# EAGLE design ISPAdapter (EAGLE 7.6.0)
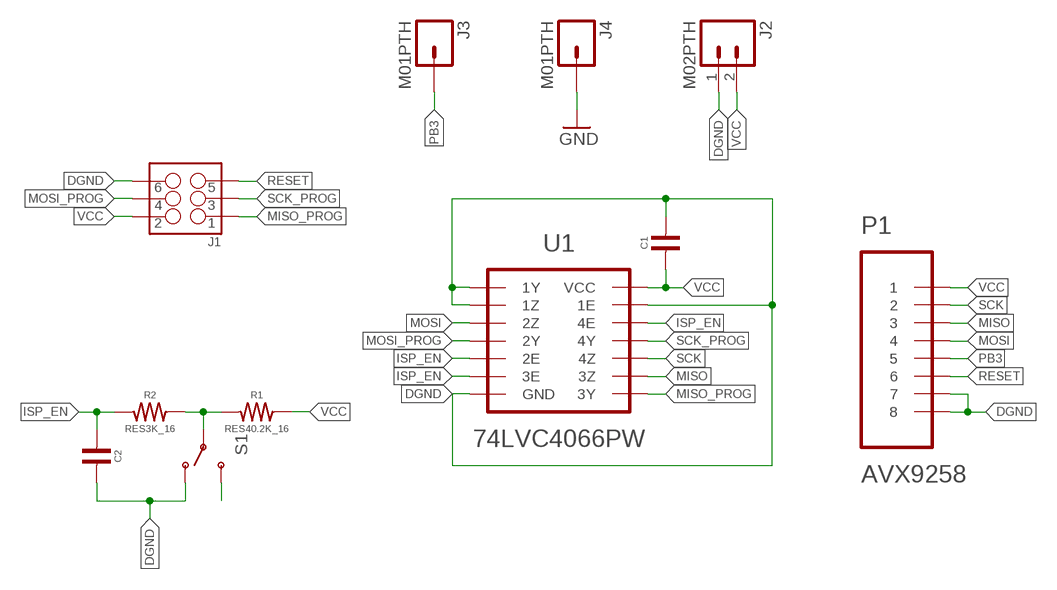
[diagram p0: schematic, sheet 1]

## Parts
C1  CAP4.7UF_10V  [0402]
C2  CAP0.1UF_100V  [0402]
J1  M03X2WR  [WR-BHD-3X2]
J2  M02PTH  [1X02]
J3  M01PTH  [1X01]
J4  M01PTH  [1X01]
P1  AVX9258  [AVX9258-8C]
R1  RES40.2K_16  [0402]
R2  RES3K_16  [0402]
S1  SWITCH-SPDTESWITCH  [EG1271A]
U1  74LVC4066PW  [14-TSSOP]

## Nets
DGND: C1.2 C2.2 J1.6 J2.1 P1.7 P1.8 S1.1(O) S1.4(O) U1.1(1Y) U1.2(1Z) U1.7(GND) U1.13(1E)
GND: J4.1
ISP_EN: C2.1 R2.1 U1.5(2E) U1.6(3E) U1.12(4E)
MISO: P1.3 U1.9(3Z)
MISO_PROG: J1.1 U1.8(3Y)
MOSI: P1.4 U1.3(2Z)
MOSI_PROG: J1.4 U1.4(2Y)
N$1: S1.3(S) S1.6(S)
PB3: J3.1 P1.5
RESET: J1.5 P1.6
SCK: P1.2 U1.10(4Z)
SCK_PROG: J1.3 U1.11(4Y)
SWGND: R1.1 R2.2 S1.2(P) S1.5(P)
VCC: C1.1 J1.2 J2.2 P1.1 R1.2 U1.14(VCC)

## Library data of the parts
C1 = dubec:CAP: Ceramic capacitor; DIGIKEY_PART_#: 445-13820-1-ND; MANUFACTURER: TDK Corporation; MFG_PART_#: C1005X5R1A475K050BC; TEMP: X5R; TOLERANCE: ±10%; USD: 0.43
C2 = dubec:CAP: Ceramic capacitor; DIGIKEY_PART_#: 490-10458-1-ND; MANUFACTURER: Murata Electronics North America; MFG_PART_#: GRM155R62A104KE14D; TEMP: X5R; TOLERANCE: ±10%; USD: 0.65/10
J1 = SparkFun-Connectors:M03X2: 2x3 .1" header. Shrouded, with keying- CONN-10681 SMT- CONN-11415 Pogo pins- HW-11044; DIGIKEY_PART_#: 732-5394-ND; EURO: 0.85; MANUFACTURER: Wurth Electronics Inc; MFG_PART_#: 61200621621
J2 = SparkFun-Connectors:M02: Standard 2-pin 0.1" header. Use with - straight break away headers ( PRT-00116) - right angle break away headers (PRT-00553) - swiss pins (PRT-00743) - machine pins (PRT-00117) - female headers (PRT-00115) Molex polarized connector foot print use with: PRT-08233 with associated crimp pins and housings. 2.54_SCREWTERM for use with PRT-10571. 3.5mm Screw Terminal footprints for PRT-08084 5mm Screw Terminal footprints for use with PRT-08432
J3 J4 = SparkFun-Connectors:M01: Header 1 Standard 1-pin 0.1" header. Use with straight break away headers (SKU : PRT-00116), right angle break away headers (PRT-00553), swiss pins (PRT-00743), machine pins (PRT-00117), and female headers (PRT-00115).
P1 = dubec:AVX9258; DIGIKEY_PART_#: 478-5495-1-ND; EURO: 1.30; MANUFACTURER: AVX Corporation; MFG_PART_#: 009258008004063
R1 = dubec:RES: Resistor; DIGIKEY_PART_#: 541-40.2KLCT-ND; MANUFACTURER: Vishay Dale; MFG_PART_#: CRCW040240K2FKED; TEMP: ±100ppm/°C; TOLERANCE: ±1%; USD: 2.11/50
R2 = dubec:RES: Resistor; DIGIKEY_PART_#: 541-3.00KLCT-ND; EURO: 2.10/50; MANUFACTURER: Vishay Dale; MFG_PART_#: CRCW04023K00FKED; TEMP: ±100ppm/°C; TOLERANCE: ±1%
S1 = SparkFun-Electromechanical:SWITCH-SPDT: SPDT Switch Simple slide switch, Spark Fun Electronics SKU : COM-00102 DPDT SMT slide switch, AYZ0202, SWCH-08179; DIGIKEY_PART_#: EG1919-ND; EURO: 5.93/10; MANUFACTURER: E-Switch; MFG_PART_#: EG1271A
U1 = dubec:74LVC4066; DIGIKEY_PART_#: 568-3021-5-ND; EURO: 6.29/10; MANUFACTURER: NXP Semiconductors; MFG_PART_#: 74LVC4066PW,112; TEMP: -40°C ~ 125°C

## Board
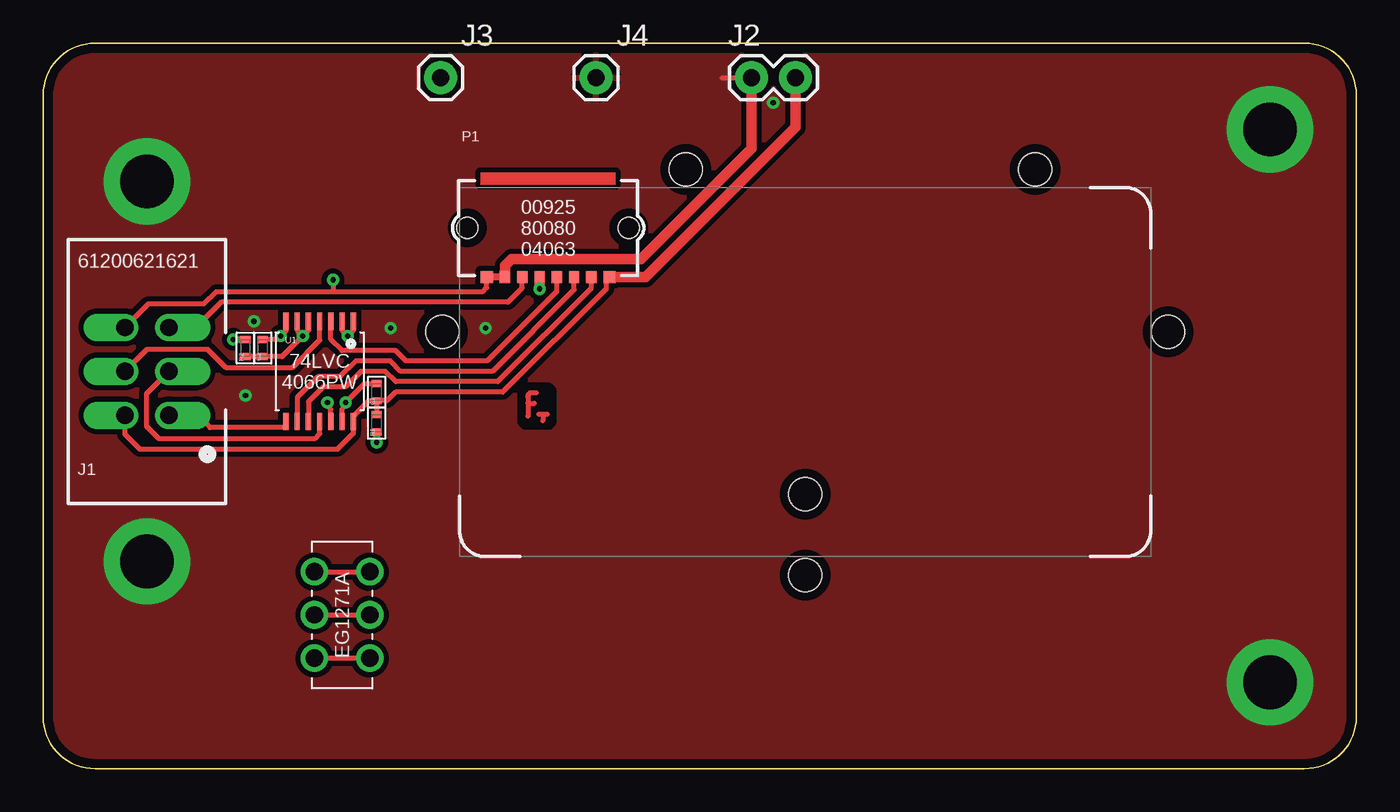
[diagram p1: board, top side]
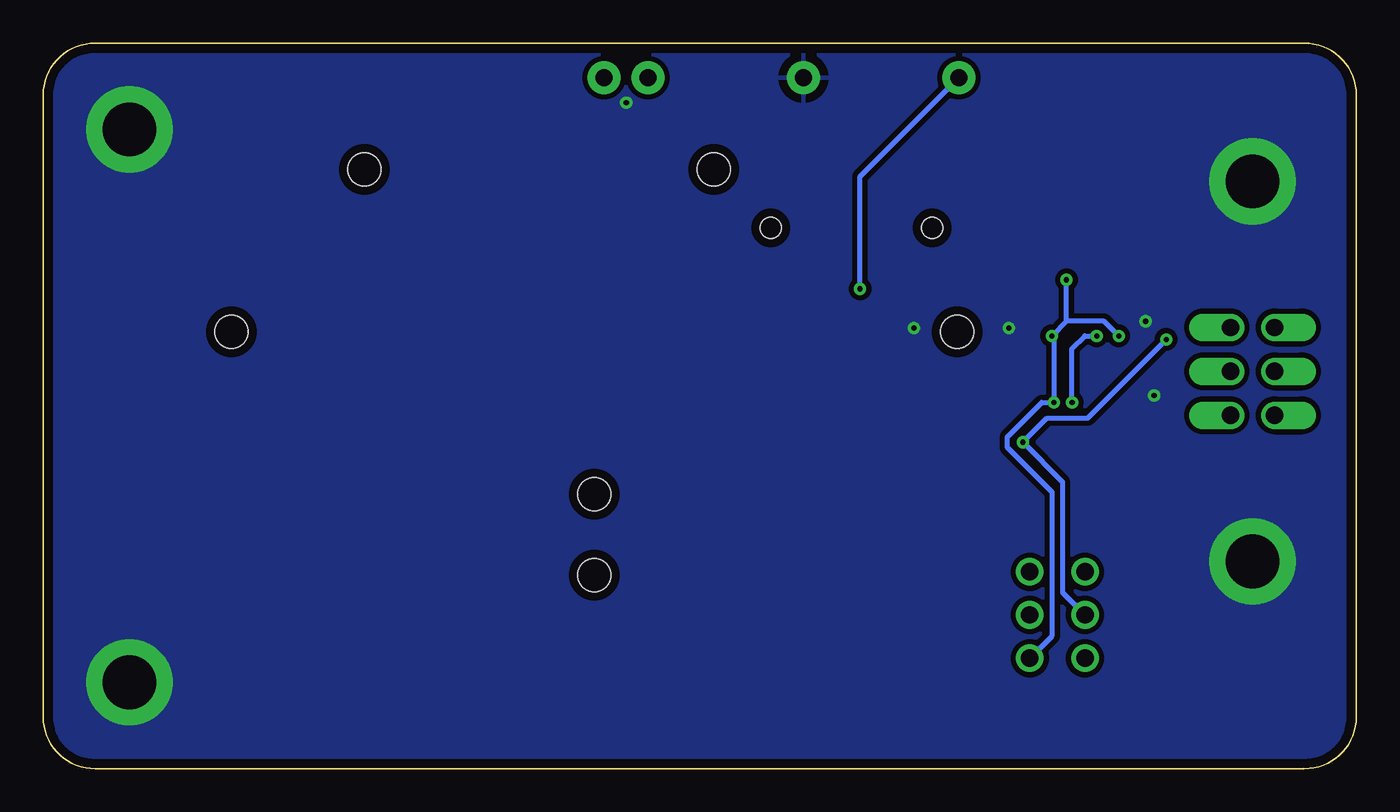
[diagram p2: board, bottom side, seen from below]

Size 76 x 42 mm. Coordinates in mm from the lower left corner, seen from the top.
Outline: 0,3 0,39 arc-90 3,42 73,42 arc-90 76,39 76,3 arc-90 73,0 3,0 arc-90 0,3
Copper layers (1*16): Top 0.035mm / dielectric 1.5mm / Bottom 0.035mm
Design rules "default *": minimum track width 0.25mm, minimum drill 0.3mm, track to track 0.3mm, track to pad 0.3mm, pad to pad 0.3mm, via to via 0.3mm, smd to smd 0mil, copper to edge 20mil, drill to drill 12mil, minimum pad ring 10mil, minimum via ring 8mil, stop-mask expansion 0mil, vias tented up to drill 1mm, thermal gap 0.5mm
Holes 1.9 mm at 37.2,34.7 57.4,34.7 65.1,25.3 23.1,25.3 44.1,15.9 44.1,11.2

### Footprints (pad centres in the part's own frame; a part is rotated, then mirrored left to right if it is on the bottom)
0402 = smd 0.4 x 0.6: 1 -0.5,0; 2 0.5,0
WR-BHD-3X2 = drill 1 pad 1.6 offset: 1 1.27,-2.54; 2 -1.27,-2.54; 3 1.27,0; 4 -1.27,0; 5 1.27,2.54; 6 -1.27,2.54
1X02 = drill 1 pad 1.9: 1 0,0; 2 2.54,0
1X01 = drill 1 pad 1.9: 1 0,0
AVX9258-8C = smd 0.7 x 0.7: 1 3.55,-2.85; 8 -3.55,-2.85 | smd 0.6 x 0.7: 2 2.5,-2.85; 3 1.5,-2.85; 4 0.5,-2.85; 5 -0.5,-2.85; 6 -1.5,-2.85; 7 -2.5,-2.85 | hole 1.2: -4.675,0; 4.675,0
EG1271A = drill 1 pad 1.6: 1 -2.5,1.6; 2 0,1.6; 3 2.5,1.6; 4 -2.5,-1.6; 5 0,-1.6; 6 2.5,-1.6
14-TSSOP = smd 1 x 0.3: 1 -2.9,1.95; 2 -2.9,1.3; 3 -2.9,0.65; 4 -2.9,0; 5 -2.9,-0.65; 6 -2.9,-1.3; 7 -2.9,-1.95; 8 2.9,-1.95; 9 2.9,-1.3; 10 2.9,-0.65; 11 2.9,0; 12 2.9,0.65; 13 2.9,1.3; 14 2.9,1.95

### Placement (x,y rotation side)
C1  19.3,21.8 90 top
C2  12.7,24.35 90 top
J1  6,23 0 top
J2  41,40 0 top
J3  23,40 0 top
J4  32,40 0 top
P1  29.23,31.3 0 top
R1  19.3,20 90 top
R2  11.7,24.35 90 top
S1  17.3,8.9 90 top
U1  16,23 270 top
U$2  [TF-EMBLEM]  28.6,21 0 top

### Tracks (layer width: path | path; a pad name or v marks a point on that pad's centre or on a via)
DGND  (via drill 0.3)
  Top 0.3: 16.77,27.6 25.43,27.6 25.68,27.85 P1.8 | 16.77,27.6 10,27.6 9.3,26.9 6.09,26.9 J1.6 | U1.1 17.95,25.38 v17.62,25.05 17.3,25.38 U1.2 | U1.13 17.3,20.8 v17.5,21.2 18.6,22.3 C1.2 | C2.2 13.55,24.85 v13.75,25.05 14.05,25.35 U1.7 | S1.4 S1.1 | v16.77,28.3 16.77,27.6
  Top 0.4: P1.7 P1.8
  Top 0.6: J2.1 41,35.9 34.6,29.5 27.1,29.5 26.73,29.12 P1.7
  Bottom 0.3: v13.75,25.05 14.6,25.9 16.77,25.9 | 16.77,25.9 v17.62,25.05 17.5,24.93 v17.5,21.2 18.2,21.2 20.2,19.2 20.2,18.6 17.6,16 17.6,7.7 S1.4 | 16.77,25.9 v16.77,28.3
GND  (via drill 0.3, 3.1 pad 5)
  Top 0.3: 39.3,40 41.1,40
  other vias: 6,34 6,12 71,37 71,5 11.7,21.6 42.25,38.55 20.1,25.5 25.6,25.5 12.2,25.9
  pour Top: 0,0 0,42 76,42 76,0
  pour Bottom: 0,0 0,42 76,42 76,0
ISP_EN  (via drill 0.3)
  Top 0.3: U1.5 15.35,25.38 v15.03,25.05 | U1.6 14.7,25.38 v15.03,25.05 | v15.03,25.05 13.82,23.85 C2.1 R2.1 | U1.12 16.65,20.8 v16.45,21.2
  Bottom 0.3: v16.45,21.2 16.45,24.32 15.72,25.05 v15.03,25.05
MISO
  Top 0.3: P1.3 30.73,27.73 26,23 20.7,23 20.1,23.6 18.1,23.6 17.2,22.7 15.9,22.7 14.7,21.5 U1.9
MISO_PROG
  Top 0.3: U1.8 14.05,19.75 9.65,19.75 8.94,20.46 J1.1
MOSI
  Top 0.3: P1.4 29.73,27.62 25.7,23.6 21,23.6 20.4,24.2 17.3,24.2 16.65,24.85 U1.3
MOSI_PROG
  Top 0.3: J1.4 6,24.27 9.53,24.27 10.6,23.2 14.4,23.2 16,24.8 U1.4
N$1
  Top 0.3: S1.3 S1.6
PB3  (via drill 0.3)
  Top 0.6: P1.5 v28.73,27.77
  Bottom 0.3: v28.73,27.77 28.73,34.27 J3.1
RESET
  Top 0.3: J1.5 8.84,25.54 10.3,27 26.9,27 27.73,27.82 P1.6
SCK
  Top 0.3: P1.2 31.73,27.82 26.3,22.4 20.4,22.4 19.8,23 18.4,23 17.5,22.1 16.2,22.1 15.35,21.25 U1.10
SCK_PROG
  Top 0.3: J1.3 6,21.73 6,19.8 6.7,19.1 15.7,19.1 16,19.4 U1.11
SWGND  (via drill 0.3)
  Top 0.3: S1.2 S1.5
  Top 0.4: R1.1 v19.3,18.9 | v11,24.85 R2.2
  Bottom 0.3: v11,24.85 15.55,20.3 17.9,20.3 v19.3,18.9 17,16.6 17,10.2 S1.2
VCC
  Top 0.3: J1.2 4.73,19.37 5.6,18.5 17.05,18.5 17.95,19.4 U1.14 17.95,20.4 18.85,21.3 C1.1 | P1.1 32.6,28.3 32.6,27.8 26.6,21.8 20.4,21.8 19.9,21.3 C1.1 | C1.1 R1.2
  Top 0.6: P1.1 34.85,28.45 43.54,37.14 J2.2

### Text on the board
tLabels: SCI / (PB3) | GND | GND | +5V | AVR ISP adapter board / for Super DUBEC | 6 | 5 | 4 | 1 | 3 | 2 | Rev. F (201x-xx-xx) | http://TURBOfunction.com/fpv | ISP/HVSP | ISP pins: | HVSP pins: | 6 GND | 5 RESET | 6 GND | 5 RESET | 4 MOSI | 3 SCK | 4 SDI | 3 SDO | debugWIRE | 2 VCC | 1 MISO | 2 VCC | 1 SII